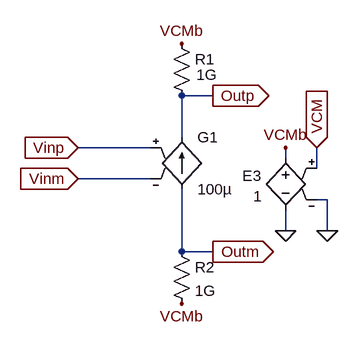
[diagram p0: schematic OTA_gm_100u.asc]
OTA_gm_100u.asc, the LTspice schematic file:
Version 4
SHEET 1 6300 744
WIRE 1488 384 1376 384
WIRE 1488 432 1376 432
WIRE 1536 368 1536 304
WIRE 1536 544 1536 448
WIRE 1584 304 1536 304
WIRE 1584 544 1536 544
WIRE 1696 400 1696 384
WIRE 1696 512 1696 480
WIRE 1744 416 1744 384
WIRE 1760 464 1744 464
WIRE 1760 512 1760 464
FLAG 1584 304 Outp
IOPIN 1584 304 Out
FLAG 1376 384 Vinp
IOPIN 1376 384 In
FLAG 1376 432 Vinm
IOPIN 1376 432 In
FLAG 1584 544 Outm
IOPIN 1584 544 Out
FLAG 1696 512 0
FLAG 1760 512 0
FLAG 1744 384 VCM
IOPIN 1744 384 In
FLAG 1696 384 VCMb
FLAG 1536 224 VCMb
FLAG 1536 624 VCMb
SYMBOL e 1696 384 M0
WINDOW 0 37 43 Left 0
WINDOW 3 36 75 Left 0
SYMATTR InstName E3
SYMATTR Value 1
SYMBOL g 1536 352 R0
SYMATTR InstName G1
SYMATTR Value 100µ
SYMBOL res 1520 208 R0
WINDOW 3 39 64 Left 0
SYMATTR Value 1G
SYMATTR InstName R1
SYMBOL res 1520 528 R0
SYMATTR InstName R2
SYMATTR Value 1G

The netlist it stands for:
* OTA_gm_100u.asc
E3 VCMb 0 VCM 0 1
G1 Outm Outp Vinp Vinm 100µ
R1 VCMb Outp 1G
R2 Outm VCMb 1G
.backanno
.end